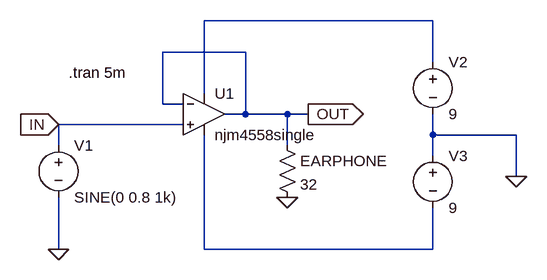
[diagram p0: schematic Circuit7_06.asc]
Circuit7_06.asc, the LTspice schematic file:
Version 4
SHEET 1 880 680
WIRE 512 96 160 96
WIRE 224 144 96 144
WIRE 512 160 512 96
WIRE 160 208 160 96
WIRE 96 224 96 144
WIRE 128 224 96 224
WIRE 224 240 224 144
WIRE 224 240 192 240
WIRE 288 240 224 240
WIRE 320 240 288 240
WIRE 128 256 -64 256
WIRE 512 272 512 240
WIRE 640 272 512 272
WIRE -64 288 -64 256
WIRE 288 288 288 240
WIRE 512 304 512 272
WIRE 640 336 640 272
WIRE -64 448 -64 368
WIRE 160 448 160 272
WIRE 512 448 512 384
WIRE 512 448 160 448
FLAG 640 336 0
FLAG -64 256 IN
IOPIN -64 256 In
FLAG 320 240 OUT
IOPIN 320 240 Out
FLAG 288 368 0
FLAG -64 448 0
SYMBOL voltage -64 272 R0
SYMATTR InstName V1
SYMATTR Value SINE(0 0.8 1k)
SYMBOL voltage 512 144 R0
SYMATTR InstName V2
SYMATTR Value 9
SYMBOL NJR_OPamp/njm4558single 160 176 R0
SYMATTR InstName U1
SYMBOL res 272 272 R0
SYMATTR InstName EARPHONE
SYMATTR Value 32
SYMBOL voltage 512 288 R0
SYMATTR InstName V3
SYMATTR Value 9
TEXT -48 176 Left 2 !.tran 5m

The netlist it stands for:
* Circuit7_06.asc
V1 IN 0 SINE(0 0.8 1k)
V2 N001 0 9
* U1: njm4558single (symbol NJR_OPamp/njm4558single not available, pins judged from their places): In+=IN In-=OUT V+=N001 V-=N002 OUT=OUT
R§EARPHONE OUT 0 32
V3 0 N002 9
.tran 5m
.backanno
.end